# Altium schematic sheet PWR2.SchDoc
size A4
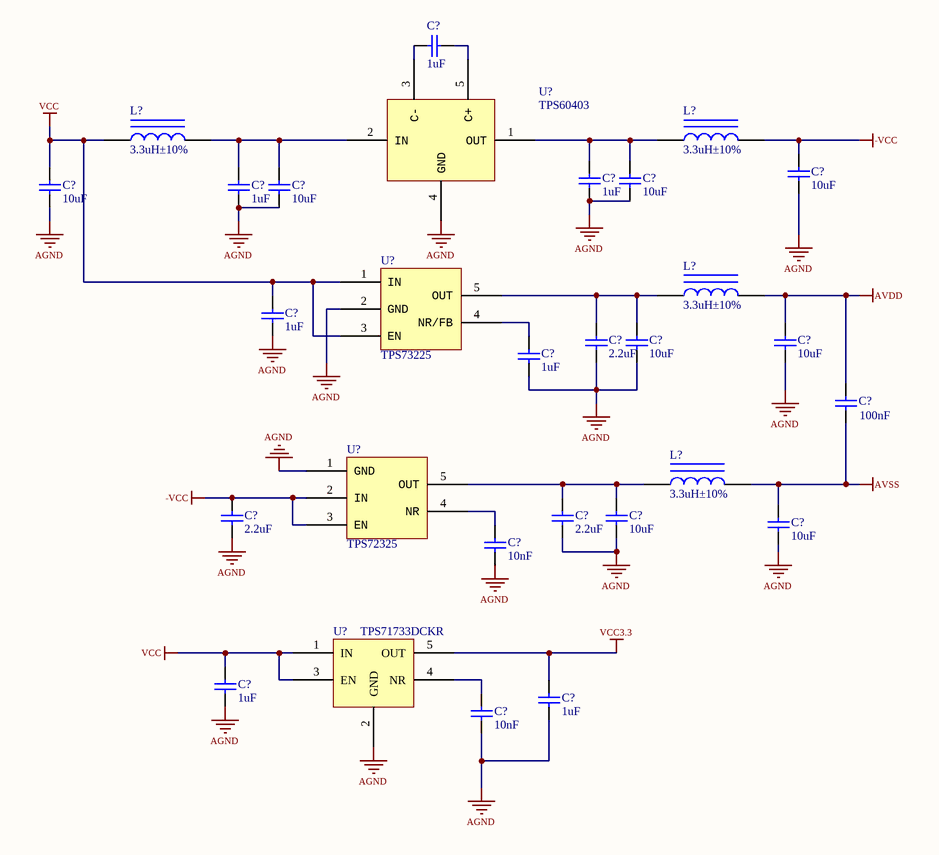
[diagram p0: PWR2.SchDoc]

## Parts
(Parts that share a designator on the sheet are numbered #1, #2 ... from top to bottom, then left to right.)
C?#1  1uF  [0402_C]
C?#2  10uF  [0402_C]
C?#3  1uF  [0402_C]
C?#4  10uF  [0402_C]
C?#5  10uF  [0402_C]
C?#6  1uF  [0402_C]
C?#7  10uF  [0402_C]
C?#8  1uF  [0402_C]
C?#9  2.2uF  [0603_C]
C?#10  10uF  [0402_C]
C?#11  10uF  [0402_C]
C?#12  1uF  [0402_C]
C?#13  100nF  [0402_C]
C?#14  2.2uF  [0603_C]
C?#15  2.2uF  [0603_C]
C?#16  10uF  [0402_C]
C?#17  10uF  [0402_C]
C?#18  10nF  [0402_C]
C?#19  1uF  [0402_C]
C?#20  1uF  [0402_C]
C?#21  10nF  [0402_C]
L?#1  3.3uH±10%  [0805_L]
L?#2  3.3uH±10%  [0805_L]
L?#3  3.3uH±10%  [0805_L]
L?#4  3.3uH±10%  [0805_L]
U?#1  TPS60403  [SOT-23-5]
U?#2  TPS73225  [SOT-23-5]
U?#3  TPS72325  [SOT-23-5]
U?#4  TPS71733DCKR  [SC-70-5]

## Nets
-VCC: C?#2.2 C?#14.2 L?#2.2 U?#3.2(IN) U?#3.3(EN)
AGND: C?#2.1 C?#3.1 C?#4.1 C?#5.1 C?#6.1 C?#7.1 C?#8.1 C?#9.1 C?#10.1 C?#11.1 C?#12.1 C?#14.1 C?#15.1 C?#16.1 C?#17.1 C?#18.1 C?#19.1 C?#20.1 C?#21.1 U?#1.4(GND) U?#2.2(GND) U?#3.1(GND) U?#4.2(GND)
AVDD: C?#11.2 C?#13.2 L?#3.2
AVSS: C?#13.1 C?#17.2 L?#4.2
VCC: C?#5.2 C?#8.2 C?#19.2 L?#1.1 U?#2.1(IN) U?#2.3(EN) U?#4.1(IN) U?#4.3(EN)
VCC3.3: C?#20.2 U?#4.5(OUT)
NetC?#1_1: C?#1.1 U?#1.5(C+)
NetC?#1_2: C?#1.2 U?#1.3(C-)
NetC?#3_2: C?#3.2 C?#4.2 L?#2.1 U?#1.1(OUT)
NetC?#6_2: C?#6.2 C?#7.2 L?#1.2 U?#1.2(IN)
NetC?#9_2: C?#9.2 C?#10.2 L?#3.1 U?#2.5(OUT)
NetC?#12_2: C?#12.2 U?#2.4(NR/FB)
NetC?#15_2: C?#15.2 C?#16.2 L?#4.1 U?#3.5(OUT)
NetC?#18_2: C?#18.2 U?#3.4(NR)
NetC?#21_2: C?#21.2 U?#4.4(NR)

## Library data of the parts
C?#1 C?#3 C?#6 C?#8 C?#12 C?#19 C?#20 = 0603 1uF (105) 10% 50V: 贴片电容; ComponentLink1Description: 供应商链接; ComponentLink1URL: http://www.szlcsc.com/product/details_16531.html; Package: 0603; Supplier: LC; SuppliersPartNumber: C15849
C?#2 C?#4 C?#5 C?#7 C?#10 C?#11 C?#16 C?#17 = 0402 10uF (106) 20% 6.3V: 贴片电容; ComponentLink1Description: 供应商链接; ComponentLink1URL: http://www.szlcsc.com/product/details_16204.html; Package: 0402; Supplier: LC; SuppliersPartNumber: C15525
C?#9 C?#14 C?#15 = 0603 2.2uF (225) 10% 16V: 贴片电容; ComponentLink1Description: 供应商链接; ComponentLink1URL: http://www.szlcsc.com/product/details_24366.html; Package: 0603; Supplier: LC; SuppliersPartNumber: C23630
C?#13 = 0402 100nF (104) 10% 16V: 贴片电容; ComponentLink1Description: 供应商链接; ComponentLink1URL: http://www.szlcsc.com/product/details_1877.html; Package: 0402; Supplier: LC; SuppliersPartNumber: C1525
C?#18 C?#21 = 0402 10nF (103) 10% 50V: 贴片电容; ComponentLink1Description: 供应商链接; ComponentLink1URL: http://www.szlcsc.com/product/details_15869.html; Package: 0402; Supplier: LC; SuppliersPartNumber: C15195
L?#1-L?#4 = 0805 3.3uH10%: 贴片电感; ComponentLink1Description: 供应商链接; ComponentLink1URL: http://www.szlcsc.com/product/details_52738.html; Package: 0805; Supplier: LC; SuppliersPartNumber: C51725